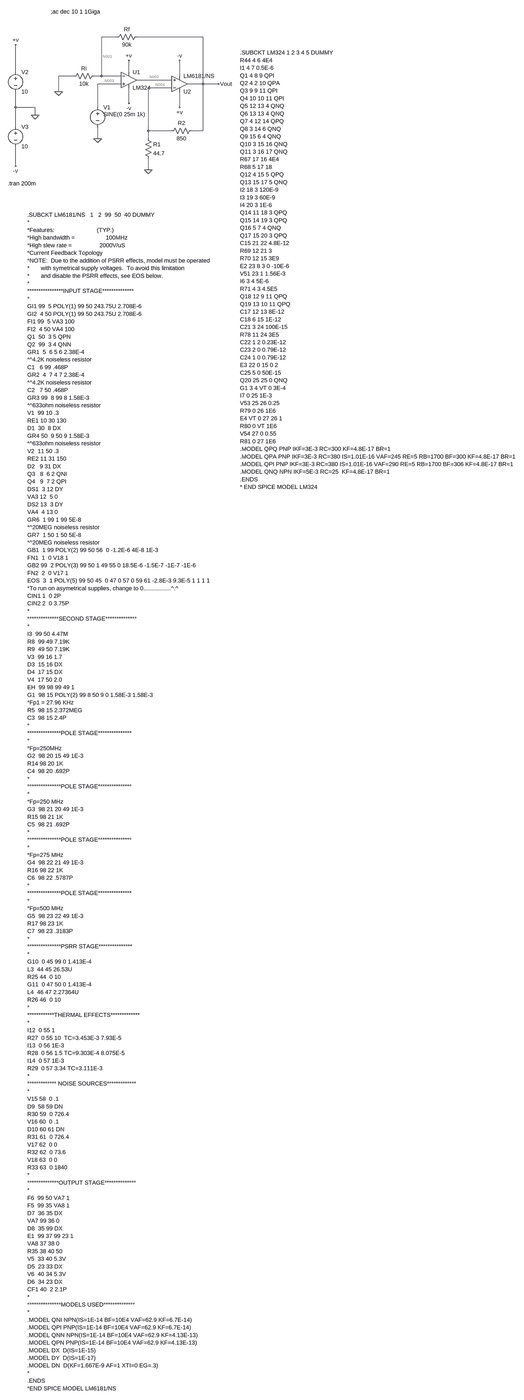
[diagram p0: schematic Laboratorio n° 3 - Circuito 2.asc, whole sheet]
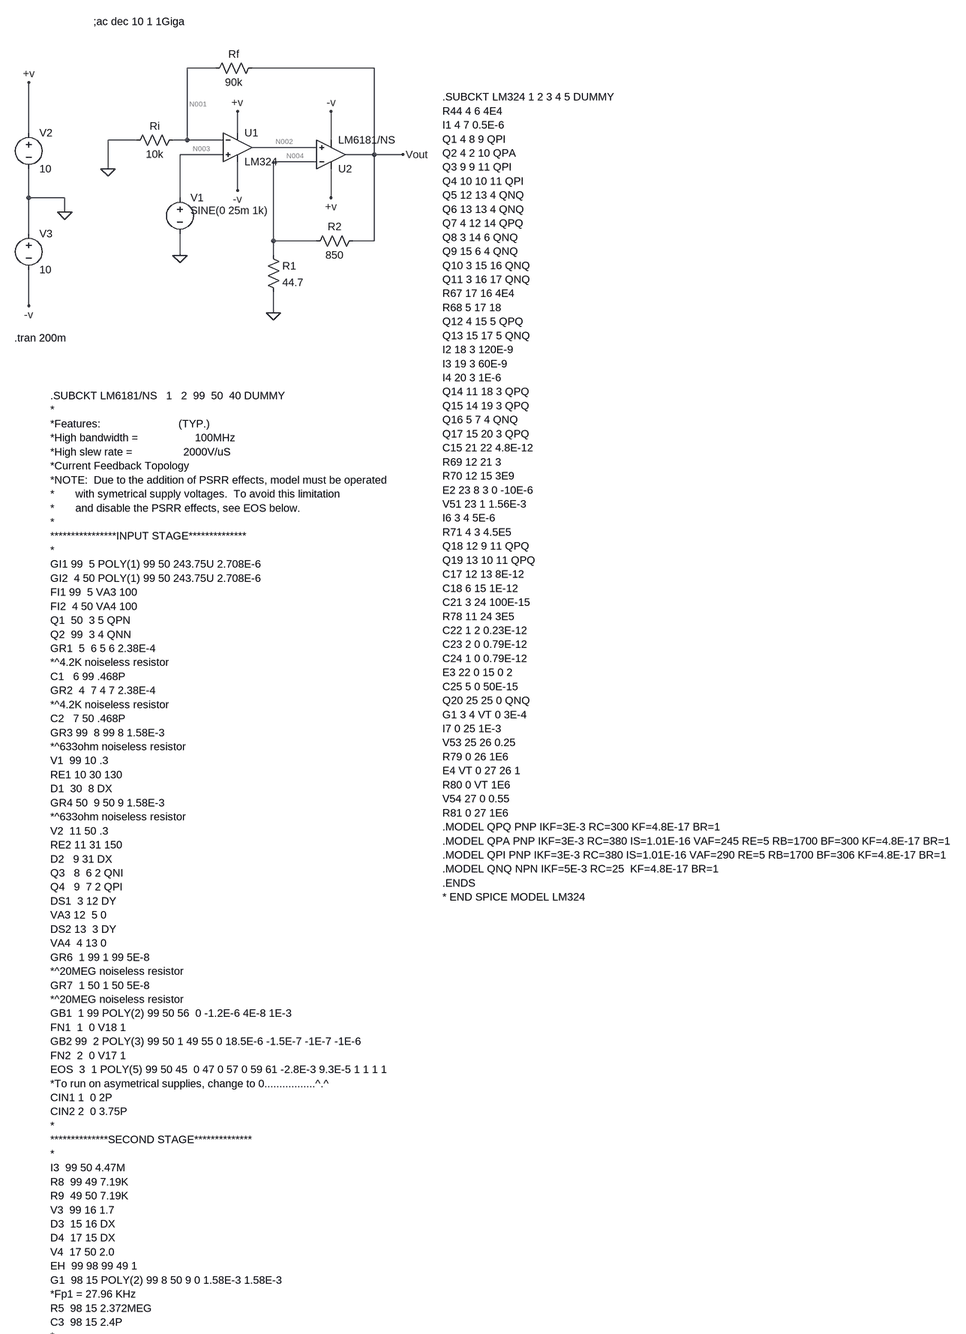
[diagram p1: schematic Laboratorio n° 3 - Circuito 2.asc, part, row 1 of 2, column 1 of 1]
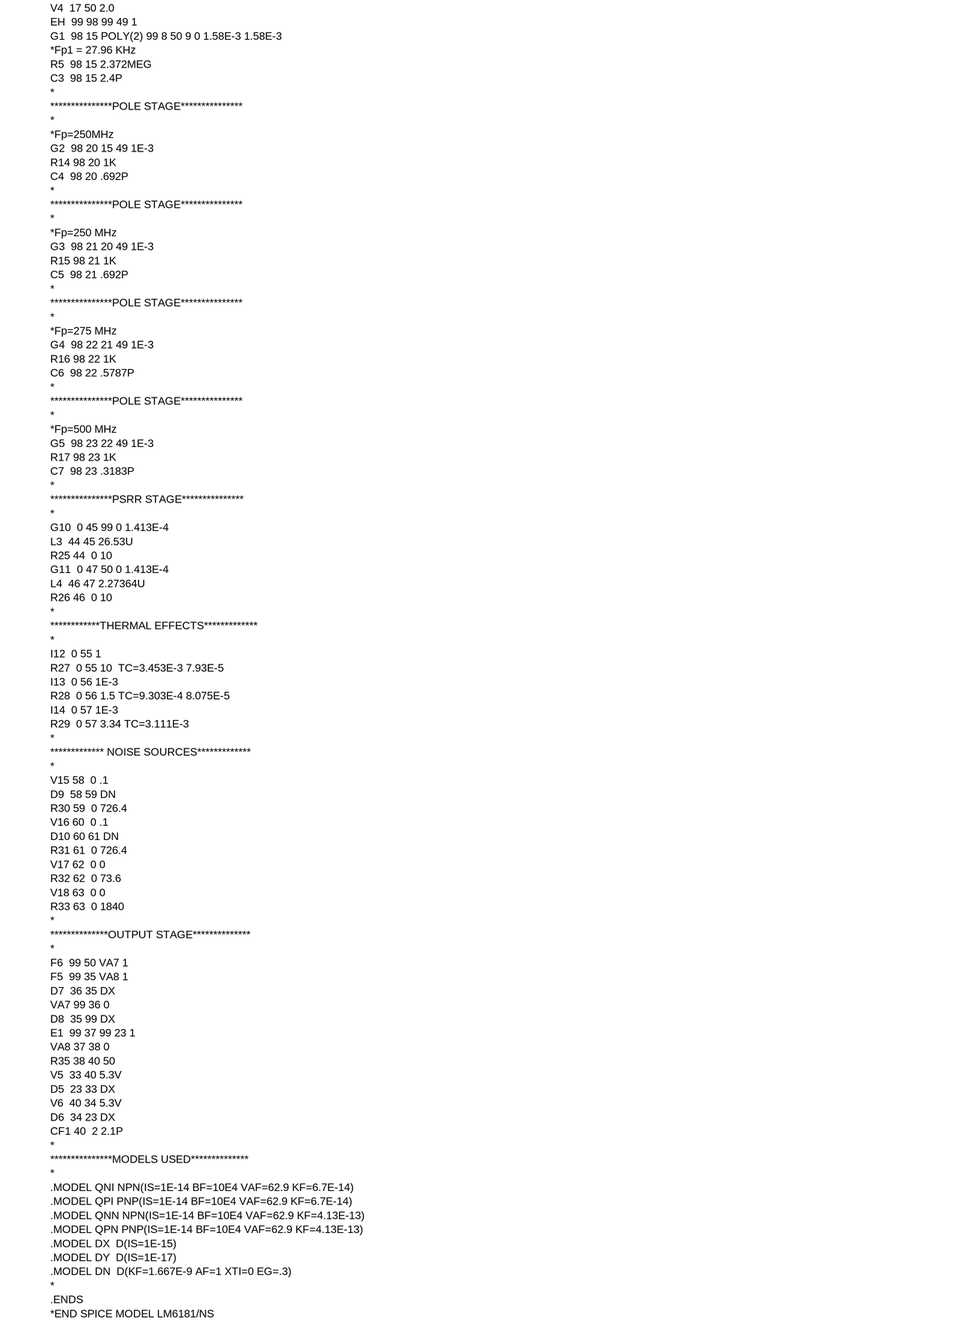
[diagram p2: schematic Laboratorio n° 3 - Circuito 2.asc, part, row 2 of 2, column 1 of 1]
Laboratorio n° 3 - Circuito 2.asc, the LTspice schematic file:
Version 4
SHEET 1 1988 4896
WIRE 288 -160 224 -160
WIRE 640 -160 368 -160
WIRE -128 -16 -128 -128
WIRE 336 -16 336 -64
WIRE 112 0 48 0
WIRE 224 0 224 -160
WIRE 224 0 192 0
WIRE 304 0 224 0
WIRE 544 0 544 -64
WIRE 512 16 368 16
WIRE 304 32 208 32
WIRE 640 32 640 -160
WIRE 640 32 576 32
WIRE 704 32 640 32
WIRE 512 48 416 48
WIRE 48 64 48 0
WIRE 336 112 336 48
WIRE -128 128 -128 64
WIRE -48 128 -128 128
WIRE 208 128 208 32
WIRE 544 128 544 64
WIRE -48 160 -48 128
WIRE -128 208 -128 128
WIRE 416 224 416 48
WIRE 512 224 416 224
WIRE 640 224 640 32
WIRE 640 224 592 224
WIRE 208 256 208 208
WIRE 416 256 416 224
WIRE -128 368 -128 288
WIRE 416 384 416 336
FLAG 416 384 0
FLAG 48 64 0
FLAG 704 32 Vout
FLAG 208 256 0
FLAG -48 160 0
FLAG -128 368 -v
FLAG -128 -128 +v
FLAG 544 128 +v
FLAG 336 112 -v
FLAG 544 -64 -v
FLAG 336 -64 +v
SYMBOL OpAmps\\UniversalOpAmp 336 16 R0
SYMATTR InstName U1
SYMATTR Value LM324
SYMBOL res 208 -16 R90
WINDOW 0 0 56 VBottom 2
WINDOW 3 32 56 VTop 2
SYMATTR InstName Ri
SYMATTR Value 10k
SYMBOL res 384 -176 R90
WINDOW 0 0 56 VBottom 2
WINDOW 3 32 56 VTop 2
SYMATTR InstName Rf
SYMATTR Value 90k
SYMBOL OpAmps\\UniversalOpAmp 544 32 M180
SYMATTR InstName U2
SYMATTR Value LM6181/NS
SYMBOL res 400 240 R0
SYMATTR InstName R1
SYMATTR Value 44.7
SYMBOL res 608 208 R90
WINDOW 0 0 56 VBottom 2
WINDOW 3 32 56 VTop 2
SYMATTR InstName R2
SYMATTR Value 850
SYMBOL voltage 208 112 R0
WINDOW 123 24 124 Left 2
WINDOW 39 0 0 Left 0
WINDOW 3 24 44 Left 2
SYMATTR InstName V1
SYMATTR Value SINE(0 25m 1k)
SYMBOL voltage -128 -32 R0
WINDOW 123 0 0 Left 0
WINDOW 39 0 0 Left 0
SYMATTR InstName V2
SYMATTR Value 10
SYMBOL voltage -128 192 R0
WINDOW 123 0 0 Left 0
WINDOW 39 0 0 Left 0
SYMATTR InstName V3
SYMATTR Value 10
TEXT -160 440 Left 2 !.tran 200m
TEXT 792 -96 Left 2 !.SUBCKT LM324 1 2 3 4 5 DUMMY\nR44 4 6 4E4\nI1 4 7 0.5E-6\nQ1 4 8 9 QPI\nQ2 4 2 10 QPA\nQ3 9 9 11 QPI\nQ4 10 10 11 QPI\nQ5 12 13 4 QNQ\nQ6 13 13 4 QNQ\nQ7 4 12 14 QPQ\nQ8 3 14 6 QNQ\nQ9 15 6 4 QNQ\nQ10 3 15 16 QNQ\nQ11 3 16 17 QNQ\nR67 17 16 4E4\nR68 5 17 18\nQ12 4 15 5 QPQ\nQ13 15 17 5 QNQ\nI2 18 3 120E-9\nI3 19 3 60E-9\nI4 20 3 1E-6\nQ14 11 18 3 QPQ\nQ15 14 19 3 QPQ\nQ16 5 7 4 QNQ\nQ17 15 20 3 QPQ\nC15 21 22 4.8E-12\nR69 12 21 3\nR70 12 15 3E9\nE2 23 8 3 0 -10E-6\nV51 23 1 1.56E-3\nI6 3 4 5E-6\nR71 4 3 4.5E5\nQ18 12 9 11 QPQ\nQ19 13 10 11 QPQ\nC17 12 13 8E-12\nC18 6 15 1E-12\nC21 3 24 100E-15\nR78 11 24 3E5\nC22 1 2 0.23E-12\nC23 2 0 0.79E-12\nC24 1 0 0.79E-12\nE3 22 0 15 0 2\nC25 5 0 50E-15\nQ20 25 25 0 QNQ\nG1 3 4 VT 0 3E-4\nI7 0 25 1E-3\nV53 25 26 0.25\nR79 0 26 1E6\nE4 VT 0 27 26 1\nR80 0 VT 1E6\nV54 27 0 0.55\nR81 0 27 1E6\n.MODEL QPQ PNP IKF=3E-3 RC=300 KF=4.8E-17 BR=1\n.MODEL QPA PNP IKF=3E-3 RC=380 IS=1.01E-16 VAF=245 RE=5 RB=1700 BF=300 KF=4.8E-17 BR=1\n.MODEL QPI PNP IKF=3E-3 RC=380 IS=1.01E-16 VAF=290 RE=5 RB=1700 BF=306 KF=4.8E-17 BR=1\n.MODEL QNQ NPN IKF=5E-3 RC=25  KF=4.8E-17 BR=1\n.ENDS\n* END SPICE MODEL LM324
TEXT -80 568 Left 2 !.SUBCKT LM6181/NS   1   2  99  50  40 DUMMY\n*\n*Features:                          (TYP.)\n*High bandwidth =                   100MHz\n*High slew rate =                 2000V/uS\n*Current Feedback Topology\n*NOTE:  Due to the addition of PSRR effects, model must be operated\n*       with symetrical supply voltages.  To avoid this limitation \n*       and disable the PSRR effects, see EOS below.\n*\n****************INPUT STAGE************** \n*\nGI1 99  5 POLY(1) 99 50 243.75U 2.708E-6\nGI2  4 50 POLY(1) 99 50 243.75U 2.708E-6\nFI1 99  5 VA3 100\nFI2  4 50 VA4 100\nQ1  50  3 5 QPN\nQ2  99  3 4 QNN \nGR1  5  6 5 6 2.38E-4\n*^4.2K noiseless resistor\nC1   6 99 .468P\nGR2  4  7 4 7 2.38E-4\n*^4.2K noiseless resistor\nC2   7 50 .468P\nGR3 99  8 99 8 1.58E-3\n*^633ohm noiseless resistor\nV1  99 10 .3\nRE1 10 30 130\nD1  30  8 DX\nGR4 50  9 50 9 1.58E-3\n*^633ohm noiseless resistor\nV2  11 50 .3\nRE2 11 31 150\nD2   9 31 DX\nQ3   8  6 2 QNI\nQ4   9  7 2 QPI\nDS1  3 12 DY\nVA3 12  5 0\nDS2 13  3 DY\nVA4  4 13 0\nGR6  1 99 1 99 5E-8\n*^20MEG noiseless resistor\nGR7  1 50 1 50 5E-8\n*^20MEG noiseless resistor\nGB1  1 99 POLY(2) 99 50 56  0 -1.2E-6 4E-8 1E-3\nFN1  1  0 V18 1\nGB2 99  2 POLY(3) 99 50 1 49 55 0 18.5E-6 -1.5E-7 -1E-7 -1E-6\nFN2  2  0 V17 1\nEOS  3  1 POLY(5) 99 50 45  0 47 0 57 0 59 61 -2.8E-3 9.3E-5 1 1 1 1\n*To run on asymetrical supplies, change to 0.................^.^\nCIN1 1  0 2P\nCIN2 2  0 3.75P\n*\n**************SECOND STAGE**************\n*\nI3  99 50 4.47M\nR8  99 49 7.19K\nR9  49 50 7.19K\nV3  99 16 1.7\nD3  15 16 DX\nD4  17 15 DX\nV4  17 50 2.0\nEH  99 98 99 49 1\nG1  98 15 POLY(2) 99 8 50 9 0 1.58E-3 1.58E-3\n*Fp1 = 27.96 KHz\nR5  98 15 2.372MEG\nC3  98 15 2.4P\n* \n***************POLE STAGE*************** \n*\n*Fp=250MHz\nG2  98 20 15 49 1E-3\nR14 98 20 1K\nC4  98 20 .692P\n*\n***************POLE STAGE*************** \n*\n*Fp=250 MHz\nG3  98 21 20 49 1E-3\nR15 98 21 1K\nC5  98 21 .692P\n*\n***************POLE STAGE*************** \n*\n*Fp=275 MHz\nG4  98 22 21 49 1E-3\nR16 98 22 1K\nC6  98 22 .5787P\n*\n***************POLE STAGE*************** \n*\n*Fp=500 MHz\nG5  98 23 22 49 1E-3\nR17 98 23 1K\nC7  98 23 .3183P\n*\n***************PSRR STAGE***************\n*\nG10  0 45 99 0 1.413E-4\nL3  44 45 26.53U\nR25 44  0 10\nG11  0 47 50 0 1.413E-4\nL4  46 47 2.27364U\nR26 46  0 10\n*\n************THERMAL EFFECTS*************\n*\nI12  0 55 1\nR27  0 55 10  TC=3.453E-3 7.93E-5\nI13  0 56 1E-3\nR28  0 56 1.5 TC=9.303E-4 8.075E-5\nI14  0 57 1E-3\nR29  0 57 3.34 TC=3.111E-3\n*\n************* NOISE SOURCES*************\n*\nV15 58  0 .1\nD9  58 59 DN\nR30 59  0 726.4\nV16 60  0 .1\nD10 60 61 DN\nR31 61  0 726.4\nV17 62  0 0\nR32 62  0 73.6\nV18 63  0 0\nR33 63  0 1840\n*\n**************OUTPUT STAGE**************\n*\nF6  99 50 VA7 1\nF5  99 35 VA8 1\nD7  36 35 DX\nVA7 99 36 0\nD8  35 99 DX\nE1  99 37 99 23 1\nVA8 37 38 0\nR35 38 40 50\nV5  33 40 5.3V\nD5  23 33 DX\nV6  40 34 5.3V\nD6  34 23 DX\nCF1 40  2 2.1P\n*\n***************MODELS USED**************\n*\n.MODEL QNI NPN(IS=1E-14 BF=10E4 VAF=62.9 KF=6.7E-14)\n.MODEL QPI PNP(IS=1E-14 BF=10E4 VAF=62.9 KF=6.7E-14)\n.MODEL QNN NPN(IS=1E-14 BF=10E4 VAF=62.9 KF=4.13E-13)\n.MODEL QPN PNP(IS=1E-14 BF=10E4 VAF=62.9 KF=4.13E-13)\n.MODEL DX  D(IS=1E-15)\n.MODEL DY  D(IS=1E-17)\n.MODEL DN  D(KF=1.667E-9 AF=1 XTI=0 EG=.3)\n*\n.ENDS\n*END SPICE MODEL LM6181/NS
TEXT 16 -264 Left 2 !;ac dec 10 1 1Giga

The netlist it stands for:
* Laboratorio n° 3 - Circuito 2.asc
XU1 N003 N001 +v -v N002 level1 LM324 Avol=1Meg GBW=10Meg Vos=0 En=0 Enk=0 In=0 Ink=0 Rin=500Meg  ; pins In+ In- V+ V- OUT
Ri N001 0 10k
Rf Vout N001 90k
XU2 N002 N004 +v -v Vout level1 LM6181/NS Avol=1Meg GBW=10Meg Vos=0 En=0 Enk=0 In=0 Ink=0 Rin=500Meg  ; pins In+ In- V+ V- OUT
R1 N004 0 44.7
R2 Vout N004 850
V1 N003 0 SINE(0 25m 1k)
V2 +v 0 10
V3 0 -v 10
.tran 200m
.SUBCKT LM324 1 2 3 4 5 DUMMY
R44 4 6 4E4
I1 4 7 0.5E-6
Q1 4 8 9 QPI
Q2 4 2 10 QPA
Q3 9 9 11 QPI
Q4 10 10 11 QPI
Q5 12 13 4 QNQ
Q6 13 13 4 QNQ
Q7 4 12 14 QPQ
Q8 3 14 6 QNQ
Q9 15 6 4 QNQ
Q10 3 15 16 QNQ
Q11 3 16 17 QNQ
R67 17 16 4E4
R68 5 17 18
Q12 4 15 5 QPQ
Q13 15 17 5 QNQ
I2 18 3 120E-9
I3 19 3 60E-9
I4 20 3 1E-6
Q14 11 18 3 QPQ
Q15 14 19 3 QPQ
Q16 5 7 4 QNQ
Q17 15 20 3 QPQ
C15 21 22 4.8E-12
R69 12 21 3
R70 12 15 3E9
E2 23 8 3 0 -10E-6
V51 23 1 1.56E-3
I6 3 4 5E-6
R71 4 3 4.5E5
Q18 12 9 11 QPQ
Q19 13 10 11 QPQ
C17 12 13 8E-12
C18 6 15 1E-12
C21 3 24 100E-15
R78 11 24 3E5
C22 1 2 0.23E-12
C23 2 0 0.79E-12
C24 1 0 0.79E-12
E3 22 0 15 0 2
C25 5 0 50E-15
Q20 25 25 0 QNQ
G1 3 4 VT 0 3E-4
I7 0 25 1E-3
V53 25 26 0.25
R79 0 26 1E6
E4 VT 0 27 26 1
R80 0 VT 1E6
V54 27 0 0.55
R81 0 27 1E6
.MODEL QPQ PNP IKF=3E-3 RC=300 KF=4.8E-17 BR=1
.MODEL QPA PNP IKF=3E-3 RC=380 IS=1.01E-16 VAF=245 RE=5 RB=1700 BF=300 KF=4.8E-17 BR=1
.MODEL QPI PNP IKF=3E-3 RC=380 IS=1.01E-16 VAF=290 RE=5 RB=1700 BF=306 KF=4.8E-17 BR=1
.MODEL QNQ NPN IKF=5E-3 RC=25  KF=4.8E-17 BR=1
.ENDS
* END SPICE MODEL LM324
.SUBCKT LM6181/NS   1   2  99  50  40 DUMMY
*
*Features:                          (TYP.)
*High bandwidth =                   100MHz
*High slew rate =                 2000V/uS
*Current Feedback Topology
*NOTE:  Due to the addition of PSRR effects, model must be operated
*       with symetrical supply voltages.  To avoid this limitation
*       and disable the PSRR effects, see EOS below.
*
****************INPUT STAGE**************
*
GI1 99  5 POLY(1) 99 50 243.75U 2.708E-6
GI2  4 50 POLY(1) 99 50 243.75U 2.708E-6
FI1 99  5 VA3 100
FI2  4 50 VA4 100
Q1  50  3 5 QPN
Q2  99  3 4 QNN
GR1  5  6 5 6 2.38E-4
*^4.2K noiseless resistor
C1   6 99 .468P
GR2  4  7 4 7 2.38E-4
*^4.2K noiseless resistor
C2   7 50 .468P
GR3 99  8 99 8 1.58E-3
*^633ohm noiseless resistor
V1  99 10 .3
RE1 10 30 130
D1  30  8 DX
GR4 50  9 50 9 1.58E-3
*^633ohm noiseless resistor
V2  11 50 .3
RE2 11 31 150
D2   9 31 DX
Q3   8  6 2 QNI
Q4   9  7 2 QPI
DS1  3 12 DY
VA3 12  5 0
DS2 13  3 DY
VA4  4 13 0
GR6  1 99 1 99 5E-8
*^20MEG noiseless resistor
GR7  1 50 1 50 5E-8
*^20MEG noiseless resistor
GB1  1 99 POLY(2) 99 50 56  0 -1.2E-6 4E-8 1E-3
FN1  1  0 V18 1
GB2 99  2 POLY(3) 99 50 1 49 55 0 18.5E-6 -1.5E-7 -1E-7 -1E-6
FN2  2  0 V17 1
EOS  3  1 POLY(5) 99 50 45  0 47 0 57 0 59 61 -2.8E-3 9.3E-5 1 1 1 1
*To run on asymetrical supplies, change to 0.................^.^
CIN1 1  0 2P
CIN2 2  0 3.75P
*
**************SECOND STAGE**************
*
I3  99 50 4.47M
R8  99 49 7.19K
R9  49 50 7.19K
V3  99 16 1.7
D3  15 16 DX
D4  17 15 DX
V4  17 50 2.0
EH  99 98 99 49 1
G1  98 15 POLY(2) 99 8 50 9 0 1.58E-3 1.58E-3
*Fp1 = 27.96 KHz
R5  98 15 2.372MEG
C3  98 15 2.4P
*
***************POLE STAGE***************
*
*Fp=250MHz
G2  98 20 15 49 1E-3
R14 98 20 1K
C4  98 20 .692P
*
***************POLE STAGE***************
*
*Fp=250 MHz
G3  98 21 20 49 1E-3
R15 98 21 1K
C5  98 21 .692P
*
***************POLE STAGE***************
*
*Fp=275 MHz
G4  98 22 21 49 1E-3
R16 98 22 1K
C6  98 22 .5787P
*
***************POLE STAGE***************
*
*Fp=500 MHz
G5  98 23 22 49 1E-3
R17 98 23 1K
C7  98 23 .3183P
*
***************PSRR STAGE***************
*
G10  0 45 99 0 1.413E-4
L3  44 45 26.53U
R25 44  0 10
G11  0 47 50 0 1.413E-4
L4  46 47 2.27364U
R26 46  0 10
*
************THERMAL EFFECTS*************
*
I12  0 55 1
R27  0 55 10  TC=3.453E-3 7.93E-5
I13  0 56 1E-3
R28  0 56 1.5 TC=9.303E-4 8.075E-5
I14  0 57 1E-3
R29  0 57 3.34 TC=3.111E-3
*
************* NOISE SOURCES*************
*
V15 58  0 .1
D9  58 59 DN
R30 59  0 726.4
V16 60  0 .1
D10 60 61 DN
R31 61  0 726.4
V17 62  0 0
R32 62  0 73.6
V18 63  0 0
R33 63  0 1840
*
**************OUTPUT STAGE**************
*
F6  99 50 VA7 1
F5  99 35 VA8 1
D7  36 35 DX
VA7 99 36 0
D8  35 99 DX
E1  99 37 99 23 1
VA8 37 38 0
R35 38 40 50
V5  33 40 5.3V
D5  23 33 DX
V6  40 34 5.3V
D6  34 23 DX
CF1 40  2 2.1P
*
***************MODELS USED**************
*
.MODEL QNI NPN(IS=1E-14 BF=10E4 VAF=62.9 KF=6.7E-14)
.MODEL QPI PNP(IS=1E-14 BF=10E4 VAF=62.9 KF=6.7E-14)
.MODEL QNN NPN(IS=1E-14 BF=10E4 VAF=62.9 KF=4.13E-13)
.MODEL QPN PNP(IS=1E-14 BF=10E4 VAF=62.9 KF=4.13E-13)
.MODEL DX  D(IS=1E-15)
.MODEL DY  D(IS=1E-17)
.MODEL DN  D(KF=1.667E-9 AF=1 XTI=0 EG=.3)
*
.ENDS
*END SPICE MODEL LM6181/NS
;ac dec 10 1 1Giga
.lib UniversalOpAmp1.lib
.backanno
.end

* Results of the author's LTspice run, read from the files saved beside the schematic
* Operating Point, zero values left out:
*   V(-v) = -10 V
*   V(n001) = -288.5 µV
*   V(+v) = 10 V
*   V(n002) = -2.355 mV
*   V(vout) = -3.77 mV
*   V(n004) = 45.13 µV
*   I(Ri) = -28.85 nA
*   I(Rf) = -38.69 nA
*   I(R1) = 1.01 µA
*   I(R2) = -4.489 µA
*   I(V1) = 9.319 nA
*   I(V2) = -6.996 mA
*   I(V3) = -6.995 mA
*   Ix(u1:1) = -9.319 nA
*   Ix(u1:2) = -9.84 nA
*   Ix(u1:3) = 239.8 µA
*   Ix(u1:4) = -238.7 µA
*   Ix(u1:5) = -1.1 µA
*   Ix(u2:1) = 1.1 µA
*   Ix(u2:2) = -5.499 µA
*   Ix(u2:99) = 6.756 mA
*   Ix(u2:50) = -6.756 mA
*   Ix(u2:40) = 4.528 µA
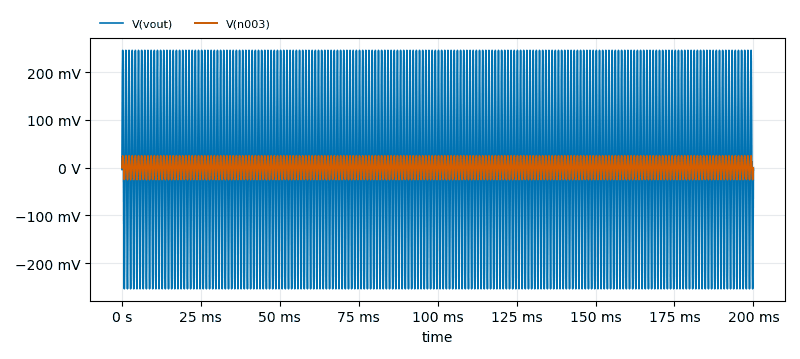
[diagram p3: Transient Analysis of Laboratorio n° 3 - Circuito 2.asc, plotted from the saved traces]
* Transient Analysis, 1 run:
*   V(vout): min -253.8 mV, max 245.8 mV, average -3.829 mV, rms 177.2 mV, last -3.894 mV
*   V(n003): min -25 mV, max 24.95 mV, average -5.814 µV, rms 17.71 mV, last 0 V